# Altium project Orient.PrjPcb (part 4 of 6)

## Sheet FPGA_Banks_Anti_Alias.SchDoc
size A
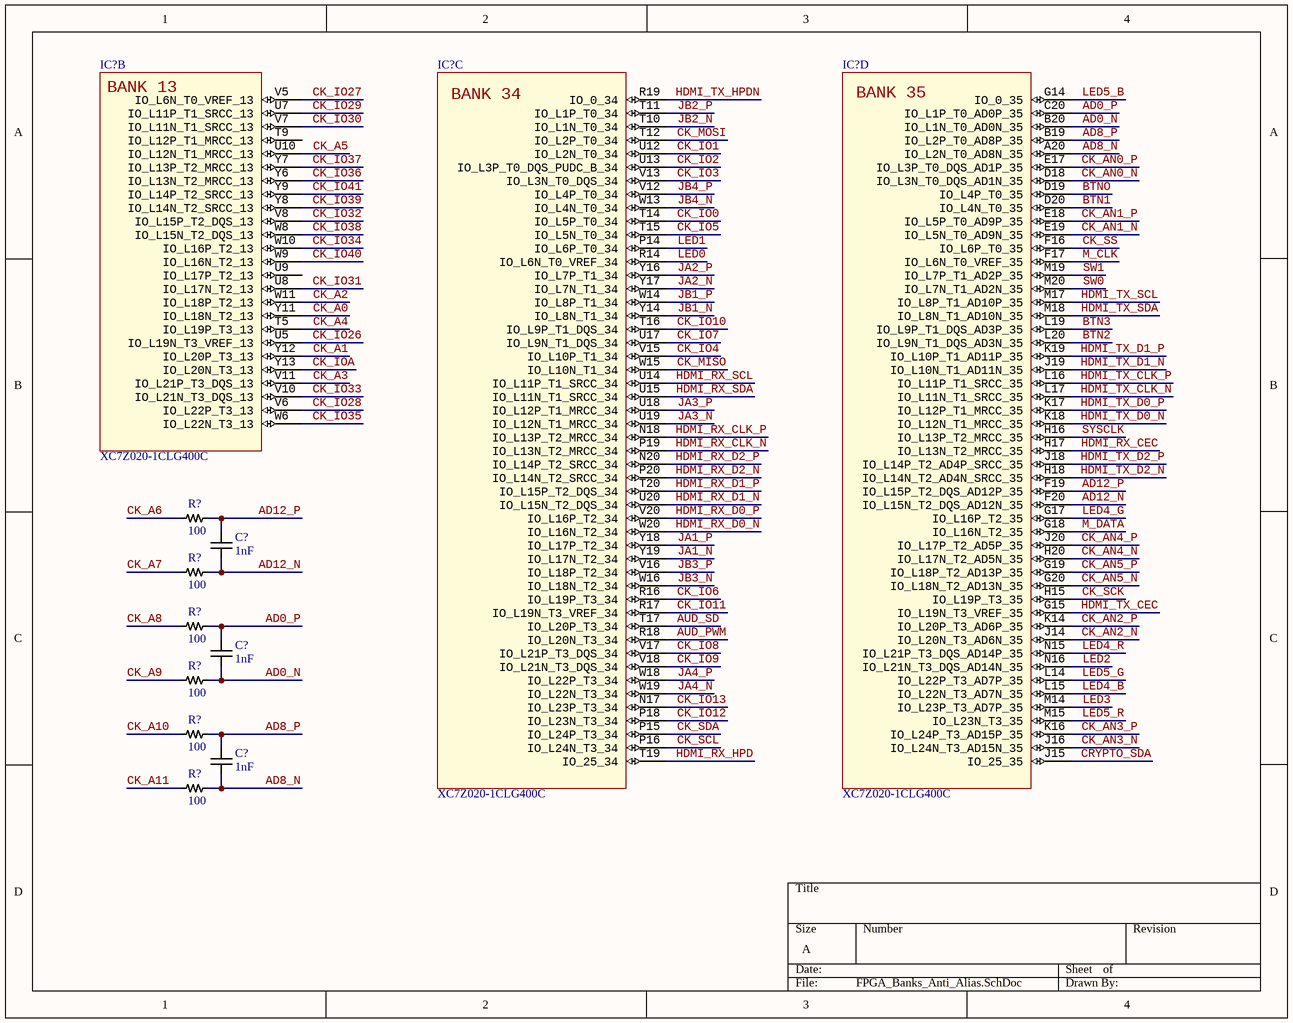
[diagram p6: FPGA_Banks_Anti_Alias.SchDoc]

### Parts
(Parts that share a designator on the sheet are numbered #1, #2 ... from top to bottom, then left to right.)
C?#13  1nF  [CAP0402]
C?#14  1nF  [CAP0402]
C?#15  1nF  [CAP0402]
IC?#8  XC7Z020-1CLG400C  [BGA400]  (part B of 9)
IC?#9  XC7Z020-1CLG400C  [BGA400]  (part C of 9)
IC?#10  XC7Z020-1CLG400C  [BGA400]  (part D of 9)
R?#129  100  [RES0402]
R?#130  100  [RES0402]
R?#131  100  [RES0402]
R?#132  100  [RES0402]
R?#133  100  [RES0402]
R?#134  100  [RES0402]

### Nets
AD0_N: C?#14.2 IC?#10.B20(IO_L1N_T0_AD0N_35) R?#132.2
AD0_P: C?#14.1 IC?#10.C20(IO_L1P_T0_AD0P_35) R?#131.2
AD8_N: C?#15.2 IC?#10.A20(IO_L2N_T0_AD8N_35) R?#134.2
AD8_P: C?#15.1 IC?#10.B19(IO_L2P_T0_AD8P_35) R?#133.2
AD12_N: C?#13.2 IC?#10.F20(IO_L15N_T2_DQS_AD12N_35) R?#130.2
AD12_P: C?#13.1 IC?#10.F19(IO_L15P_T2_DQS_AD12P_35) R?#129.2
AUD_PWM: IC?#9.R18(IO_L20N_T3_34)
AUD_SD: IC?#9.T17(IO_L20P_T3_34)
BTN1: IC?#10.D20(IO_L4N_T0_35)
BTN2: IC?#10.L20(IO_L9N_T1_DQS_AD3N_35)
BTN3: IC?#10.L19(IO_L9P_T1_DQS_AD3P_35)
BTNO: IC?#10.D19(IO_L4P_T0_35)
CK_A0: IC?#8.Y11(IO_L18N_T2_13)
CK_A1: IC?#8.Y12(IO_L20P_T3_13)
CK_A2: IC?#8.W11(IO_L18P_T2_13)
CK_A3: IC?#8.V11(IO_L21P_T3_DQS_13)
CK_A4: IC?#8.T5(IO_L19P_T3_13)
CK_A5: IC?#8.U10(IO_L12N_T1_MRCC_13)
CK_A6: R?#129.1
CK_A7: R?#130.1
CK_A8: R?#131.1
CK_A9: R?#132.1
CK_A10: R?#133.1
CK_A11: R?#134.1
CK_AN0_N: IC?#10.D18(IO_L3N_T0_DQS_AD1N_35)
CK_AN0_P: IC?#10.E17(IO_L3P_T0_DQS_AD1P_35)
CK_AN1_N: IC?#10.E19(IO_L5N_T0_AD9N_35)
CK_AN1_P: IC?#10.E18(IO_L5P_T0_AD9P_35)
CK_AN2_N: IC?#10.J14(IO_L20N_T3_AD6N_35)
CK_AN2_P: IC?#10.K14(IO_L20P_T3_AD6P_35)
CK_AN3_N: IC?#10.J16(IO_L24N_T3_AD15N_35)
CK_AN3_P: IC?#10.K16(IO_L24P_T3_AD15P_35)
CK_AN4_N: IC?#10.H20(IO_L17N_T2_AD5N_35)
CK_AN4_P: IC?#10.J20(IO_L17P_T2_AD5P_35)
CK_AN5_N: IC?#10.G20(IO_L18N_T2_AD13N_35)
CK_AN5_P: IC?#10.G19(IO_L18P_T2_AD13P_35)
CK_IO0: IC?#9.T14(IO_L5P_T0_34)
CK_IO1: IC?#9.U12(IO_L2N_T0_34)
CK_IO2: IC?#9.U13(IO_L3P_T0_DQS_PUDC_B_34)
CK_IO3: IC?#9.V13(IO_L3N_T0_DQS_34)
CK_IO4: IC?#9.V15(IO_L10P_T1_34)
CK_IO5: IC?#9.T15(IO_L5N_T0_34)
CK_IO6: IC?#9.R16(IO_L19P_T3_34)
CK_IO7: IC?#9.U17(IO_L9N_T1_DQS_34)
CK_IO8: IC?#9.V17(IO_L21P_T3_DQS_34)
CK_IO9: IC?#9.V18(IO_L21N_T3_DQS_34)
CK_IO10: IC?#9.T16(IO_L9P_T1_DQS_34)
CK_IO11: IC?#9.R17(IO_L19N_T3_VREF_34)
CK_IO12: IC?#9.P18(IO_L23N_T3_34)
CK_IO13: IC?#9.N17(IO_L23P_T3_34)
CK_IO26: IC?#8.U5(IO_L19N_T3_VREF_13)
CK_IO27: IC?#8.V5(IO_L6N_T0_VREF_13)
CK_IO28: IC?#8.V6(IO_L22P_T3_13)
CK_IO29: IC?#8.U7(IO_L11P_T1_SRCC_13)
CK_IO30: IC?#8.V7(IO_L11N_T1_SRCC_13)
CK_IO31: IC?#8.U8(IO_L17N_T2_13)
CK_IO32: IC?#8.V8(IO_L15P_T2_DQS_13)
CK_IO33: IC?#8.V10(IO_L21N_T3_DQS_13)
CK_IO34: IC?#8.W10(IO_L16P_T2_13)
CK_IO35: IC?#8.W6(IO_L22N_T3_13)
CK_IO36: IC?#8.Y6(IO_L13N_T2_MRCC_13)
CK_IO37: IC?#8.Y7(IO_L13P_T2_MRCC_13)
CK_IO38: IC?#8.W8(IO_L15N_T2_DQS_13)
CK_IO39: IC?#8.Y8(IO_L14N_T2_SRCC_13)
CK_IO40: IC?#8.W9(IO_L16N_T2_13)
CK_IO41: IC?#8.Y9(IO_L14P_T2_SRCC_13)
CK_IOA: IC?#8.Y13(IO_L20N_T3_13)
CK_MISO: IC?#9.W15(IO_L10N_T1_34)
CK_MOSI: IC?#9.T12(IO_L2P_T0_34)
CK_SCK: IC?#10.H15(IO_L19P_T3_35)
CK_SCL: IC?#9.P16(IO_L24N_T3_34)
CK_SDA: IC?#9.P15(IO_L24P_T3_34)
CK_SS: IC?#10.F16(IO_L6P_T0_35)
CRYPTO_SDA: IC?#10.J15(IO_25_35)
HDMI_RX_CEC: IC?#10.H17(IO_L13N_T2_MRCC_35)
HDMI_RX_CLK_N: IC?#9.P19(IO_L13N_T2_MRCC_34)
HDMI_RX_CLK_P: IC?#9.N18(IO_L13P_T2_MRCC_34)
HDMI_RX_D0_N: IC?#9.W20(IO_L16N_T2_34)
HDMI_RX_D0_P: IC?#9.V20(IO_L16P_T2_34)
HDMI_RX_D1_N: IC?#9.U20(IO_L15N_T2_DQS_34)
HDMI_RX_D1_P: IC?#9.T20(IO_L15P_T2_DQS_34)
HDMI_RX_D2_N: IC?#9.P20(IO_L14N_T2_SRCC_34)
HDMI_RX_D2_P: IC?#9.N20(IO_L14P_T2_SRCC_34)
HDMI_RX_HPD: IC?#9.T19(IO_25_34)
HDMI_RX_SCL: IC?#9.U14(IO_L11P_T1_SRCC_34)
HDMI_RX_SDA: IC?#9.U15(IO_L11N_T1_SRCC_34)
HDMI_TX_CEC: IC?#10.G15(IO_L19N_T3_VREF_35)
HDMI_TX_CLK_N: IC?#10.L17(IO_L11N_T1_SRCC_35)
HDMI_TX_CLK_P: IC?#10.L16(IO_L11P_T1_SRCC_35)
HDMI_TX_D0_N: IC?#10.K18(IO_L12N_T1_MRCC_35)
HDMI_TX_D0_P: IC?#10.K17(IO_L12P_T1_MRCC_35)
HDMI_TX_D1_N: IC?#10.J19(IO_L10N_T1_AD11N_35)
HDMI_TX_D1_P: IC?#10.K19(IO_L10P_T1_AD11P_35)
HDMI_TX_D2_N: IC?#10.H18(IO_L14N_T2_AD4N_SRCC_35)
HDMI_TX_D2_P: IC?#10.J18(IO_L14P_T2_AD4P_SRCC_35)
HDMI_TX_HPDN: IC?#9.R19(IO_0_34)
HDMI_TX_SCL: IC?#10.M17(IO_L8P_T1_AD10P_35)
HDMI_TX_SDA: IC?#10.M18(IO_L8N_T1_AD10N_35)
JA1_N: IC?#9.Y19(IO_L17N_T2_34)
JA1_P: IC?#9.Y18(IO_L17P_T2_34)
JA2_N: IC?#9.Y17(IO_L7N_T1_34)
JA2_P: IC?#9.Y16(IO_L7P_T1_34)
JA3_N: IC?#9.U19(IO_L12N_T1_MRCC_34)
JA3_P: IC?#9.U18(IO_L12P_T1_MRCC_34)
JA4_N: IC?#9.W19(IO_L22N_T3_34)
JA4_P: IC?#9.W18(IO_L22P_T3_34)
JB1_N: IC?#9.Y14(IO_L8N_T1_34)
JB1_P: IC?#9.W14(IO_L8P_T1_34)
JB2_N: IC?#9.T10(IO_L1N_T0_34)
JB2_P: IC?#9.T11(IO_L1P_T0_34)
JB3_N: IC?#9.W16(IO_L18N_T2_34)
JB3_P: IC?#9.V16(IO_L18P_T2_34)
JB4_N: IC?#9.W13(IO_L4N_T0_34)
JB4_P: IC?#9.V12(IO_L4P_T0_34)
LED0: IC?#9.R14(IO_L6N_T0_VREF_34)
LED1: IC?#9.P14(IO_L6P_T0_34)
LED2: IC?#10.N16(IO_L21N_T3_DQS_AD14N_35)
LED3: IC?#10.M14(IO_L23P_T3_AD7P_35)
LED4_B: IC?#10.L15(IO_L22N_T3_AD7N_35)
LED4_G: IC?#10.G17(IO_L16P_T2_35)
LED4_R: IC?#10.N15(IO_L21P_T3_DQS_AD14P_35)
LED5_B: IC?#10.G14(IO_0_35)
LED5_G: IC?#10.L14(IO_L22P_T3_AD7P_35)
LED5_R: IC?#10.M15(IO_L23N_T3_35)
M_CLK: IC?#10.F17(IO_L6N_T0_VREF_35)
M_DATA: IC?#10.G18(IO_L16N_T2_35)
SW0: IC?#10.M20(IO_L7N_T1_AD2N_35)
SW1: IC?#10.M19(IO_L7P_T1_AD2P_35)
SYSCLK: IC?#10.H16(IO_L13P_T2_MRCC_35)

Not connected (* = marked no-connect by the designer): IC?#8 T9(IO_L12P_T1_MRCC_13) U9(IO_L17P_T2_13)

### Notes on the sheet
- (in symbol XC7Z020-1CLG400C, part B) BANK 13
- (in symbol XC7Z020-1CLG400C, part C) BANK 34
- (in symbol XC7Z020-1CLG400C, part D) BANK 35

### Library data of the parts
C?#13-C?#15 = GCM155R71H102KA37D: MLCC 1nF 0402 SMD; Manufacturer: Murata; Voltage Rating: 50V; Tolerance: 10%; Dielectric: X7R; Supplier 1: Digi-Key; Manufacturer Part Number: GCM155R71H102KA37D; Stock 1: 18060146; Pricing 1: 1=0.10000, 10=0.03900, 100=0.01720, 500=0.01228, 1000=0.00965, 2500=0.00878, 5000=0.00807 (USD); RoHS: Yes; Mount: Surface Mount; Case/Package: 0402; Case Code (Metric): 1005; Case Code (Imperial): 0402; Min Operating Temperature: -55°C; Max Operating Temperature: 125°C; Package Quantity: 1; Capacitance: 1nF; Packaging: Tape and Reel; Voltage Rating (DC): 50V; Termination: SMD/SMT; Voltage: 50V; Length: 1mm; Height: 0.5mm; Width: 0.02inch; Thickness: 0.022inch; Depth: 0.5mm; Ratings: AEC-Q200; Radiation Hardening: No; REACH SVHC: No SVHC; Lead Free: Lead Free; ComponentLink1URL: https://datasheet.ciiva.com/130/product-130720.pdf?src-supplier=Digi-Key; ComponentLink1Description: https://datasheet.ciiva.com/130/product-130720.pdf?src-supplier=Digi-Key; ComponentLink2URL: https://datasheet.ciiva.com/18183/getdatasheetpartid-140970-18183520.pdf?src-supplier=Verical; ComponentLink2Description: https://datasheet.ciiva.com/18183/getdatasheetpartid-140970-18183520.pdf?src-supplier=Verical; ComponentLink3URL: https://datasheet.ciiva.com/3778/3103gcm155r71h102ka3723-3778878.pdf?src-supplier=Arrow; ComponentLink3Description: https://datasheet.ciiva.com/3778/3103gcm155r71h102ka3723-3778878.pdf?src-supplier=Arrow; ComponentLink4URL: https://datasheet.ciiva.com/11786/0900766b80ef92d0-11786143.pdf?src-supplier=RSComponents; ComponentLink4Description: https://datasheet.ciiva.com/11786/0900766b80ef92d0-11786143.pdf?src-supplier=RSComponents; ComponentLink5URL: https://datasheet.ciiva.com/16213/product-16213384.pdf?src-supplier=Future+Electronics; ComponentLink5Description: https://datasheet.ciiva.com/16213/product-16213384.pdf?src-supplier=Future+Electronics
IC?#8-IC?#10 = XC7Z020-1CLG400C: Zynq-7000 SoC.; ComponentLink1Description: Digi-Key; ComponentLink1URL: https://www.digikey.com/product-detail/en/xilinx-inc/XC7Z020-1CLG400C/122-1851-ND/3925758?utm_adgroup=Integrated Circuits&slid=&gclid=Cj0KCQjwn_LrBRD4ARIsAFEQFKtYXIOPieaS_xsLL2AvFALkVw3M5siD0KQOWM0owpA_yiQuHKATBqcaAuQ6EALw_wcB
R?#129-R?#134 = RC0402FR-07100RL: Resistor 100Ohm 0402 SMD; Manufacturer: Yageo; Power Rating: 62.5mW; Tolerance: 1%; Voltage Rating: 50V; Resistance: 100R; Temperature Coefficient: 100ppm/°C; Supplier 1: Digi-Key; Manufacturer Part Number: RC0402FR-07100RL; Stock 1: 46531178; Pricing 1: 1=0.10000, 10=0.01600, 100=0.00670, 1000=0.00301, 2500=0.00261, 5000=0.00215 (USD); RoHS: Yes; Case/Package: 0402; Number of Pins: 2; Case Code (Imperial): 0402; Case Code (Metric): 1005; Min Operating Temperature: -55°C; Max Operating Temperature: 155°C; Packaging: Tape and Reel; Termination: SMD/SMT; Composition: Thick Film; Military Standard: Not; Voltage Rating (DC): 50V; Length: 1mm; Height: 0.32mm; Depth: 0.5mm; Width: 0.5mm; REACH SVHC: No SVHC; Lead Free: Lead Free; ComponentLink1URL: https://datasheet.ciiva.com/7849/1784430-7849810.pdf?src-supplier=Element14; ComponentLink1Description: https://datasheet.ciiva.com/7849/1784430-7849810.pdf?src-supplier=Element14; ComponentLink2URL: https://datasheet.ciiva.com/11808/0900766b80c66297-11808765.pdf?src-supplier=RSComponents; ComponentLink2Description: https://datasheet.ciiva.com/11808/0900766b80c66297-11808765.pdf?src-supplier=RSComponents; ComponentLink3URL: https://datasheet.ciiva.com/12667/pyu-rc0402-51-rohs-l-6-r-12667957.pdf?src-supplier=Mouser; ComponentLink3Description: https://datasheet.ciiva.com/12667/pyu-rc0402-51-rohs-l-6-r-12667957.pdf?src-supplier=Mouser; ComponentLink4URL: https://datasheet.ciiva.com/22747/1018594-22747511.pdf?src-supplier=Element14; ComponentLink4Description: https://datasheet.ciiva.com/22747/1018594-22747511.pdf?src-supplier=Element14; ComponentLink5URL: https://datasheet.ciiva.com/28367/1018594-28367226.pdf?src-supplier=Element14; ComponentLink5Description: https://datasheet.ciiva.com/28367/1018594-28367226.pdf?src-supplier=Element14; ComponentLink6URL: https://datasheet.ciiva.com/16740/pyu-rc0402-51-rohs-l-6-r-16740566.pdf?src-supplier=Future+Electronics; ComponentLink6Description: https://datasheet.ciiva.com/16740/pyu-rc0402-51-rohs-l-6-r-16740566.pdf?src-supplier=Future+Electronics; ComponentLink7URL: https://datasheet.ciiva.com/15189/getdatasheetpartid-329466-15189335.pdf?src-supplier=Verical; ComponentLink7Description: https://datasheet.ciiva.com/15189/getdatasheetpartid-329466-15189335.pdf?src-supplier=Verical

## Sheet FPGA_Power.SchDoc
size A
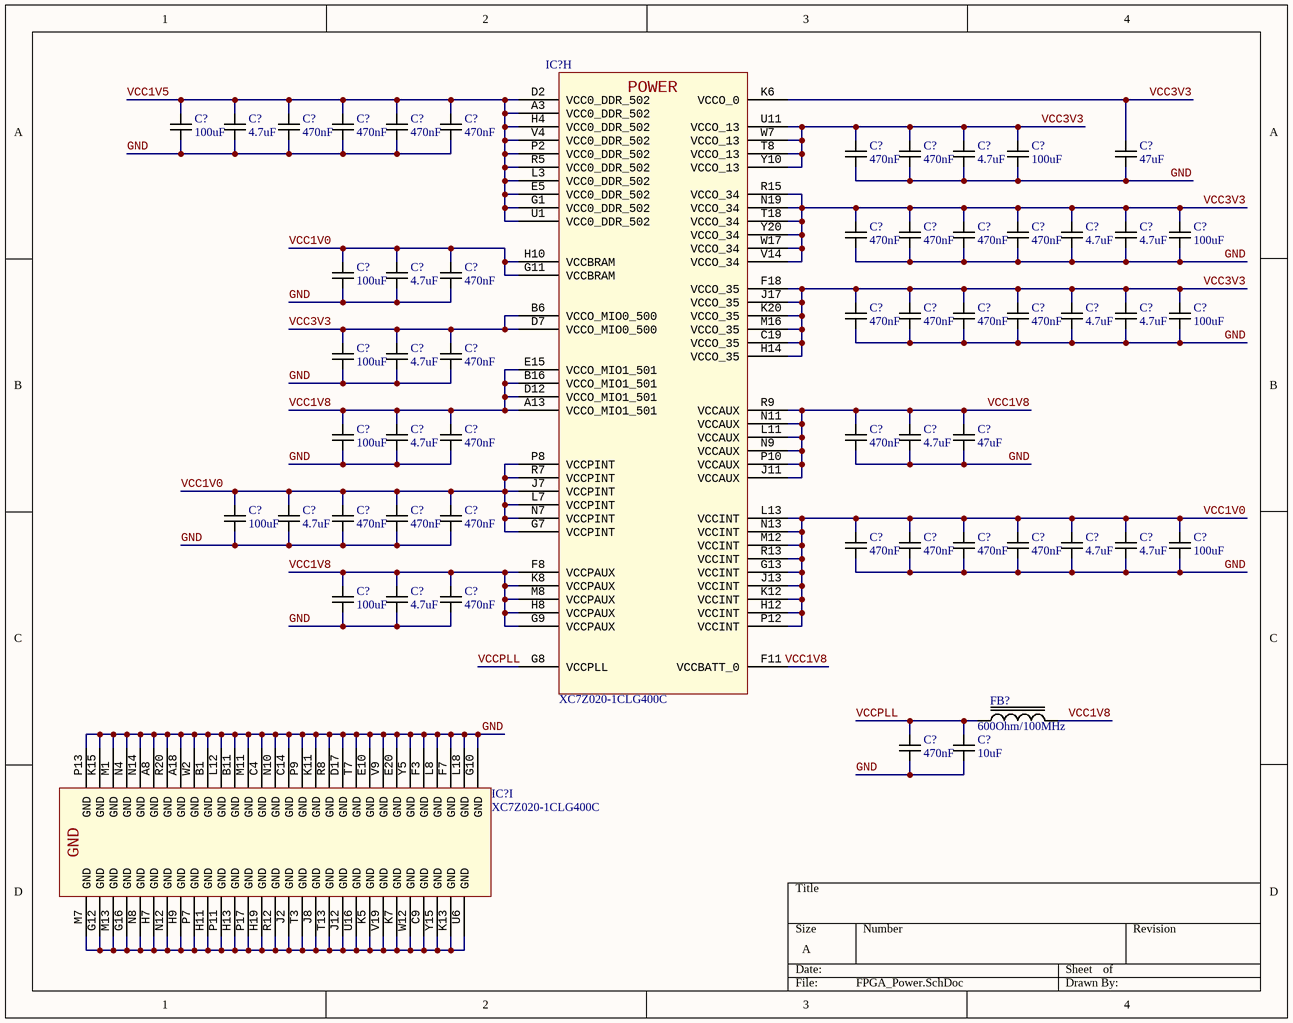
[diagram p7: FPGA_Power.SchDoc]

### Parts
(Parts that share a designator on the sheet are numbered #1, #2 ... from top to bottom, then left to right.)
C?#16  100uF
C?#17  4.7uF  [CAP0805]
C?#18  470nF  [CAP0603]
C?#19  470nF  [CAP0603]
C?#20  470nF  [CAP0603]
C?#21  470nF  [CAP0603]
C?#22  470nF  [CAP0603]
C?#23  470nF  [CAP0603]
C?#24  4.7uF  [CAP0805]
C?#25  100uF
C?#26  47uF  [CAP1210]
C?#27  470nF  [CAP0603]
C?#28  470nF  [CAP0603]
C?#29  470nF  [CAP0603]
C?#30  470nF  [CAP0603]
C?#31  4.7uF  [CAP0805]
C?#32  4.7uF  [CAP0805]
C?#33  100uF
C?#34  100uF
C?#35  4.7uF  [CAP0805]
C?#36  470nF  [CAP0603]
C?#37  470nF  [CAP0603]
C?#38  470nF  [CAP0603]
C?#39  470nF  [CAP0603]
C?#40  470nF  [CAP0603]
C?#41  4.7uF  [CAP0805]
C?#42  4.7uF  [CAP0805]
C?#43  100uF
C?#44  100uF
C?#45  4.7uF  [CAP0805]
C?#46  470nF  [CAP0603]
C?#47  100uF
C?#48  4.7uF  [CAP0805]
C?#49  470nF  [CAP0603]
C?#50  470nF  [CAP0603]
C?#51  4.7uF  [CAP0805]
C?#52  47uF  [CAP1210]
C?#53  100uF
C?#54  4.7uF  [CAP0805]
C?#55  470nF  [CAP0603]
C?#56  470nF  [CAP0603]
C?#57  470nF  [CAP0603]
C?#58  470nF  [CAP0603]
C?#59  470nF  [CAP0603]
C?#60  470nF  [CAP0603]
C?#61  470nF  [CAP0603]
C?#62  4.7uF  [CAP0805]
C?#63  4.7uF  [CAP0805]
C?#64  100uF
C?#65  100uF
C?#66  4.7uF  [CAP0805]
C?#67  470nF  [CAP0603]
C?#68  470nF  [CAP0603]
C?#69  10uF  [CAP0805]
FB?#4  600Ohm/100MHz  [FB0805]
IC?#11  XC7Z020-1CLG400C  [BGA400]  (part H of 9)
IC?#12  XC7Z020-1CLG400C  [BGA400]  (part I of 9)

### Nets
GND: C?#16.?2 C?#17.2 C?#18.2 C?#19.2 C?#20.2 C?#21.2 C?#22.2 C?#23.2 C?#24.2 C?#25.?2 C?#26.2 C?#27.2 C?#28.2 C?#29.2 C?#30.2 C?#31.2 C?#32.2 C?#33.?2 C?#34.?2 C?#35.2 C?#36.2 C?#37.2 C?#38.2 C?#39.2 C?#40.2 C?#41.2 C?#42.2 C?#43.?2 C?#44.?2 C?#45.2 C?#46.2 C?#47.?2 C?#48.2 C?#49.2 C?#50.2 C?#51.2 C?#52.2 C?#53.?2 C?#54.2 C?#55.2 C?#56.2 C?#57.2 C?#58.2 C?#59.2 C?#60.2 C?#61.2 C?#62.2 C?#63.2 C?#64.?2 C?#65.?2 C?#66.2 C?#67.2 C?#68.2 C?#69.2 IC?#12.A8(GND) IC?#12.A18(GND) IC?#12.B1(GND) IC?#12.B11(GND) IC?#12.C4(GND) IC?#12.C14(GND) IC?#12.D17(GND) IC?#12.E10(GND) IC?#12.E20(GND) IC?#12.F3(GND) IC?#12.F7(GND) IC?#12.G10(GND) IC?#12.K11(GND) IC?#12.K15(GND) IC?#12.L8(GND) IC?#12.L12(GND) IC?#12.L18(GND) IC?#12.M1(GND) IC?#12.M11(GND) IC?#12.N4(GND) IC?#12.N10(GND) IC?#12.N14(GND) IC?#12.P9(GND) IC?#12.P13(GND) IC?#12.R8(GND) IC?#12.R20(GND) IC?#12.T7(GND) IC?#12.V9(GND) IC?#12.W2(GND) IC?#12.Y5(GND)
VCC1V0: C?#34.?1 C?#35.1 C?#36.1 C?#53.?1 C?#54.1 C?#55.1 C?#56.1 C?#57.1 C?#58.1 C?#59.1 C?#60.1 C?#61.1 C?#62.1 C?#63.1 C?#64.?1 IC?#11.G7(VCCPINT) IC?#11.G11(VCCBRAM) IC?#11.G13(VCCINT) IC?#11.H10(VCCBRAM) IC?#11.H12(VCCINT) IC?#11.J7(VCCPINT) IC?#11.J13(VCCINT) IC?#11.K12(VCCINT) IC?#11.L7(VCCPINT) IC?#11.L13(VCCINT) IC?#11.M12(VCCINT) IC?#11.N7(VCCPINT) IC?#11.N13(VCCINT) IC?#11.P8(VCCPINT) IC?#11.P12(VCCINT) IC?#11.R7(VCCPINT) IC?#11.R13(VCCINT)
VCC1V5: C?#16.?1 C?#17.1 C?#18.1 C?#19.1 C?#20.1 C?#21.1 IC?#11.A3(VCC0_DDR_502) IC?#11.D2(VCC0_DDR_502) IC?#11.E5(VCC0_DDR_502) IC?#11.G1(VCC0_DDR_502) IC?#11.H4(VCC0_DDR_502) IC?#11.L3(VCC0_DDR_502) IC?#11.P2(VCC0_DDR_502) IC?#11.R5(VCC0_DDR_502) IC?#11.U1(VCC0_DDR_502) IC?#11.V4(VCC0_DDR_502)
VCC1V8: C?#47.?1 C?#48.1 C?#49.1 C?#50.1 C?#51.1 C?#52.1 C?#65.?1 C?#66.1 C?#67.1 FB?#4.2 IC?#11.A13(VCCO_MIO1_501) IC?#11.B16(VCCO_MIO1_501) IC?#11.D12(VCCO_MIO1_501) IC?#11.E15(VCCO_MIO1_501) IC?#11.F8(VCCPAUX) IC?#11.F11(VCCBATT_0) IC?#11.G9(VCCPAUX) IC?#11.H8(VCCPAUX) IC?#11.J11(VCCAUX) IC?#11.K8(VCCPAUX) IC?#11.L11(VCCAUX) IC?#11.M8(VCCPAUX) IC?#11.N9(VCCAUX) IC?#11.N11(VCCAUX) IC?#11.P10(VCCAUX) IC?#11.R9(VCCAUX)
VCC3V3: C?#22.1 C?#23.1 C?#24.1 C?#25.?1 C?#26.1 C?#27.1 C?#28.1 C?#29.1 C?#30.1 C?#31.1 C?#32.1 C?#33.?1 C?#37.1 C?#38.1 C?#39.1 C?#40.1 C?#41.1 C?#42.1 C?#43.?1 C?#44.?1 C?#45.1 C?#46.1 IC?#11.B6(VCCO_MIO0_500) IC?#11.C19(VCCO_35) IC?#11.D7(VCCO_MIO0_500) IC?#11.F18(VCCO_35) IC?#11.H14(VCCO_35) IC?#11.J17(VCCO_35) IC?#11.K6(VCCO_0) IC?#11.K20(VCCO_35) IC?#11.M16(VCCO_35) IC?#11.N19(VCCO_34) IC?#11.R15(VCCO_34) IC?#11.T8(VCCO_13) IC?#11.T18(VCCO_34) IC?#11.U11(VCCO_13) IC?#11.V14(VCCO_34) IC?#11.W7(VCCO_13) IC?#11.W17(VCCO_34) IC?#11.Y10(VCCO_13) IC?#11.Y20(VCCO_34)
VCCPLL: C?#68.1 C?#69.1 FB?#4.1 IC?#11.G8(VCCPLL)
NetIC?#12_C9: IC?#12.C9(GND) IC?#12.G12(GND) IC?#12.G16(GND) IC?#12.H7(GND) IC?#12.H9(GND) IC?#12.H11(GND) IC?#12.H13(GND) IC?#12.H19(GND) IC?#12.J2(GND) IC?#12.J8(GND) IC?#12.J12(GND) IC?#12.K5(GND) IC?#12.K7(GND) IC?#12.K13(GND) IC?#12.M7(GND) IC?#12.M13(GND) IC?#12.N8(GND) IC?#12.N12(GND) IC?#12.P7(GND) IC?#12.P11(GND) IC?#12.P17(GND) IC?#12.R12(GND) IC?#12.T3(GND) IC?#12.T13(GND) IC?#12.U6(GND) IC?#12.U16(GND) IC?#12.V19(GND) IC?#12.W12(GND) IC?#12.Y15(GND)

### Notes on the sheet
- (in symbol XC7Z020-1CLG400C, part H) POWER

### Library data of the parts
C?#16 C?#25 C?#33 C?#34 C?#43 C?#44 C?#47 C?#53 C?#64 C?#65 = 100uF: MLCC 100uF 1210 SMD; Manufacturer: Murata; Manufacturer Part Number: GRM32EE70G107ME19L; Material: Ceramic; Tolerance: 20%; Voltage Rating (DC): 4V; Dielectric: X7U; Supplier 1: Digi-Key; Stock 1: 18905; Pricing 1: 1=1.27000, 10=1.00100, 100=0.75060, 500=0.56716 (USD); RoHS: Yes; Mount: Surface Mount; Case/Package: 1210; Number of Pins: 2; Case Code (Imperial): 1210; Case Code (Metric): 3225; Min Operating Temperature: -55°C; Max Operating Temperature: 125°C; Capacitance: 100uF; Packaging: Tape and Reel; Termination: SMD/SMT; Voltage Rating: 4V; Package Quantity: 1; Length: 3.2mm; Height: 2.5mm; Width: 2.5mm; Thickness: 0.106inch; Depth: 2.5mm; Lead Pitch: 1mm; Radiation Hardening: No; REACH SVHC: No SVHC; Lead Free: Lead Free; ComponentLink1URL: https://datasheet.ciiva.com/5422/product-5422439.pdf?src-supplier=Mouser; ComponentLink1Description: https://datasheet.ciiva.com/5422/product-5422439.pdf?src-supplier=Mouser; ComponentLink2URL: https://datasheet.ciiva.com/6264/partnumbering-e-01-6264538.pdf?src-supplier=Digi-Key; ComponentLink2Description: https://datasheet.ciiva.com/6264/partnumbering-e-01-6264538.pdf?src-supplier=Digi-Key; ComponentLink3URL: https://datasheet.ciiva.com/7719/1303574-7719178.pdf?src-supplier=Element14; ComponentLink3Description: https://datasheet.ciiva.com/7719/1303574-7719178.pdf?src-supplier=Element14; ComponentLink4URL: https://datasheet.ciiva.com/6264/partnumbering-e-01-6264539.pdf?src-supplier=Digi-Key; ComponentLink4Description: https://datasheet.ciiva.com/6264/partnumbering-e-01-6264539.pdf?src-supplier=Digi-Key; ComponentLink5URL: https://datasheet.ciiva.com/14116/grmseries-highdielectrictype-eng-14116427.pdf?src-supplier=Distrelec; ComponentLink5Description: https://datasheet.ciiva.com/14116/grmseries-highdielectrictype-eng-14116427.pdf?src-supplier=Distrelec; ComponentLink6URL: https://datasheet.ciiva.com/6264/partnumbering-e-01-6264540.pdf?src-supplier=Digi-Key; ComponentLink6Description: https://datasheet.ciiva.com/6264/partnumbering-e-01-6264540.pdf?src-supplier=Digi-Key; ComponentLink7URL: https://datasheet.ciiva.com/11605/product-11605486.pdf?src-supplier=Avnet; ComponentLink7Description: https://datasheet.ciiva.com/11605/product-11605486.pdf?src-supplier=Avnet
C?#17 C?#24 C?#31 C?#32 C?#35 C?#41 C?#42 C?#45 C?#48 C?#51 C?#54 C?#62 C?#63 C?#66 = C2012X7R1A475K085AC: MLCC 4.7uF 0805 SMD; Manufacturer: TDK; Dielectric Material: Ceramic; Tolerance: 10%; Voltage Rating: 10V; Dielectric: X7R; Supplier 1: Digi-Key; Manufacturer Part Number: C2012X7R1A475K085AC; Stock 1: 87407; Pricing 1: 1=0.22000, 10=0.15200, 100=0.08600, 500=0.06072, 1000=0.05313 (USD); RoHS: Yes; Mount: Surface Mount; Case/Package: 0805; Case Code (Metric): 2012; Case Code (Imperial): 0805; Min Operating Temperature: -55°C; Max Operating Temperature: 125°C; Package Quantity: 4000; Packaging: Cut Tape; Capacitance: 4.7uF; Voltage Rating (DC): 10V; Length: 0.079inch; Width: 0.049inch; Thickness: 0.039inch; REACH SVHC: No SVHC; Lead Free: Lead Free; ComponentLink1URL: https://datasheet.ciiva.com/14886/tdkmlcccaprange-14886121.pdf?src-supplier=Digi-Key; ComponentLink1Description: https://datasheet.ciiva.com/14886/tdkmlcccaprange-14886121.pdf?src-supplier=Digi-Key; ComponentLink2URL: https://product.tdk.com/info/en/catalog/datasheets/mlcc_commercial_general_en.pdf; ComponentLink2Description: https://product.tdk.com/info/en/catalog/datasheets/mlcc_commercial_general_en.pdf
C?#18-C?#23 C?#27-C?#30 C?#36-C?#40 C?#46 C?#49 C?#50 C?#55-C?#61 C?#67 C?#68 = GRM188R70J474KA01D: MLCC 470nF 0603 SMD; pin to pad: 2>none; Manufacturer: Murata; Voltage Rating: 6.3V; Tolerance: 10%; Dielectric: X7R; Supplier 1: Digi-Key; Manufacturer Part Number: GRM188R70J474KA01D; Stock 1: 92537; Pricing 1: 1=0.17000, 10=0.11700, 100=0.05940, 500=0.04066, 1000=0.03597 (USD); RoHS: Yes; Mount: Surface Mount; Case/Package: 0603; Case Code (Metric): 1608; Case Code (Imperial): 0603; Min Operating Temperature: -55°C; Max Operating Temperature: 125°C; Package Quantity: 4000; Capacitance: 470nF; Packaging: Tape and Reel; Voltage Rating (DC): 6.3V; Termination: SMD/SMT; Length: 1.6mm; Height: 0.8mm; Width: 0.031inch; Thickness: 0.035inch; Depth: 0.8mm; Radiation Hardening: No; Lead Free: Lead Free; ComponentLink1URL: https://datasheet.ciiva.com/6264/product-6264161.pdf?src-supplier=Digi-Key; ComponentLink1Description: https://datasheet.ciiva.com/6264/product-6264161.pdf?src-supplier=Digi-Key; ComponentLink2URL: https://datasheet.ciiva.com/11673/product-11673478.pdf?src-supplier=Avnet; ComponentLink2Description: https://datasheet.ciiva.com/11673/product-11673478.pdf?src-supplier=Avnet; ComponentLink3URL: https://datasheet.ciiva.com/6264/partnumbering-e-01-6264159.pdf?src-supplier=Digi-Key; ComponentLink3Description: https://datasheet.ciiva.com/6264/partnumbering-e-01-6264159.pdf?src-supplier=Digi-Key
C?#26 C?#52 = GRM32ER70J476ME20L: MLCC 47uF 1210 SMD; Manufacturer: Murata; Tolerance: 20%; Voltage Rating: 6.3V; Dielectric: X7R; Supplier 1: Digi-Key; Manufacturer Part Number: GRM32ER70J476ME20L; Stock 1: 32926; Pricing 1: 1=2.11000, 10=1.70900, 100=1.30480, 500=0.99416 (USD); RoHS: Yes; Mount: Surface Mount; Case/Package: 1210; Case Code (Metric): 3225; Case Code (Imperial): 1210; Min Operating Temperature: -55°C; Max Operating Temperature: 125°C; Package Quantity: 1; Packaging: Tape and Reel; Capacitance: 47uF; Voltage Rating (DC): 6.3V; Termination: SMD/SMT; Length: 3.2mm; Height: 2.5mm; Width: 0.098inch; Thickness: 0.106inch; Depth: 2.5mm; Radiation Hardening: No; Lead Free: Lead Free; ComponentLink1URL: https://datasheet.ciiva.com/6264/partnumbering-e-01-6264582.pdf?src-supplier=Digi-Key; ComponentLink1Description: https://datasheet.ciiva.com/6264/partnumbering-e-01-6264582.pdf?src-supplier=Digi-Key; ComponentLink2URL: https://datasheet.ciiva.com/6264/partnumbering-e-01-6264583.pdf?src-supplier=Digi-Key; ComponentLink2Description: https://datasheet.ciiva.com/6264/partnumbering-e-01-6264583.pdf?src-supplier=Digi-Key; ComponentLink3URL: https://datasheet.ciiva.com/6264/partnumbering-e-01-6264585.pdf?src-supplier=Digi-Key; ComponentLink3Description: https://datasheet.ciiva.com/6264/partnumbering-e-01-6264585.pdf?src-supplier=Digi-Key; ComponentLink4URL: https://datasheet.ciiva.com/16497/product-16497003.pdf?src-supplier=Future+Electronics; ComponentLink4Description: https://datasheet.ciiva.com/16497/product-16497003.pdf?src-supplier=Future+Electronics
C?#69 = 08056D106KAT2A: MLCC 10uF 0805 SMD; Manufacturer: Kyocera AVX; Dielectric Material: Ceramic; Voltage Rating: 6.3V; Tolerance: 10%; Dielectric: X5R; Insulation Resistance: 500MR; Supplier 1: Digi-Key; Manufacturer Part Number: 08056D106KAT2A; Stock 1: 217962; Pricing 1: 1=0.50000, 10=0.35100, 100=0.23100, 500=0.17112, 1000=0.14545 (USD); RoHS: Yes; Mount: Surface Mount,PCB; Case/Package: 0805; Number of Pins: 2; Case Code (Imperial): 0805; Case Code (Metric): 2012; Min Operating Temperature: -55°C; Max Operating Temperature: 85°C; Capacitance: 10uF; Package Quantity: 1; Voltage Rating (DC): 6.3V; Packaging: Tape and Reel; Termination: SMD/SMT; Voltage: 6.3V; Length: 2.01mm; Height: 1.4mm; Width: 1.25mm; Thickness: 0.055inch; Depth: 1.25mm; Radiation Hardening: No; REACH SVHC: No SVHC; Lead Free: Lead Free; ComponentLink1URL: https://datasheet.ciiva.com/11788/0900766b80def1a5-11788549.pdf?src-supplier=RSComponents; ComponentLink1Description: https://datasheet.ciiva.com/11788/0900766b80def1a5-11788549.pdf?src-supplier=RSComponents; ComponentLink2URL: https://datasheet.ciiva.com/19467/2012662-19467718.pdf?src-supplier=Jameco; ComponentLink2Description: https://datasheet.ciiva.com/19467/2012662-19467718.pdf?src-supplier=Jameco; ComponentLink3URL: https://datasheet.ciiva.com/151/cx5r-151672.pdf?src-supplier=Digi-Key; ComponentLink3Description: https://datasheet.ciiva.com/151/cx5r-151672.pdf?src-supplier=Digi-Key; ComponentLink4URL: https://datasheet.ciiva.com/7812/26587-7812184.pdf?src-supplier=Element14; ComponentLink4Description: https://datasheet.ciiva.com/7812/26587-7812184.pdf?src-supplier=Element14; ComponentLink5URL: https://datasheet.ciiva.com/14598/70001028-14598616.pdf?src-supplier=Allied+Electronics; ComponentLink5Description: https://datasheet.ciiva.com/14598/70001028-14598616.pdf?src-supplier=Allied+Electronics; ComponentLink6URL: https://datasheet.ciiva.com/151/cx5r-151673.pdf?src-supplier=Digi-Key; ComponentLink6Description: https://datasheet.ciiva.com/151/cx5r-151673.pdf?src-supplier=Digi-Key; ComponentLink7URL: https://datasheet.ciiva.com/7812/26587-7812185.pdf?src-supplier=Element14; ComponentLink7Description: https://datasheet.ciiva.com/7812/26587-7812185.pdf?src-supplier=Element14; ComponentLink8URL: https://datasheet.ciiva.com/151/cx5r-151674.pdf?src-supplier=Digi-Key; ComponentLink8Description: https://datasheet.ciiva.com/151/cx5r-151674.pdf?src-supplier=Digi-Key; ComponentLink9URL: https://datasheet.ciiva.com/7812/1666675-7812186.pdf?src-supplier=Element14; ComponentLink9Description: https://datasheet.ciiva.com/7812/1666675-7812186.pdf?src-supplier=Element14; ComponentLink10URL: https://datasheet.ciiva.com/2988/cx5r-2988044.pdf?src-supplier=Avnet; ComponentLink10Description: https://datasheet.ciiva.com/2988/cx5r-2988044.pdf?src-supplier=Avnet; ComponentLink11URL: https://datasheet.ciiva.com/16392/cx5r-16392797.pdf?src-supplier=Future+Electronics; ComponentLink11Description: https://datasheet.ciiva.com/16392/cx5r-16392797.pdf?src-supplier=Future+Electronics; ComponentLink12URL: https://datasheet.ciiva.com/16544/cx5r-16544062.pdf?src-supplier=Avnet+Asia; ComponentLink12Description: https://datasheet.ciiva.com/16544/cx5r-16544062.pdf?src-supplier=Avnet+Asia
FB?#4 = HZ0805E601R-10: Ferrite Bead 600Ohm/100MHz 0805 SMD; Manufacturer: Laird; Current Rating: 500mA; Impedance: 600R; Number of Lines: 1; DC Resistance (DCR): 300mR; Test Frequency: 100MHz; Supplier 1: Digi-Key; Manufacturer Part Number: HZ0805E601R-10; Stock 1: 4500868; Pricing 1: 1=0.10000, 10=0.04700, 25=0.04160, 50=0.03800, 100=0.03420, 250=0.02504, 500=0.01822, 1000=0.01784 (USD); RoHS: Yes; Mount: Surface Mount; Case/Package: 0805; Weight: 0.00392oz; Case Code (Metric): 2012; Case Code (Imperial): 0805; Material: Ferrite; Contact Plating: Tin,Matte; Core Material: Ferrite; Min Operating Temperature: -40°C; Max Operating Temperature: 125°C; Package Quantity: 1; Packaging: Tape and Reel; Max Current Rating: 500mA; Max DC Current: 500mA; Termination: SMD/SMT; Frequency: 100MHz; Length: 2mm; Height: 1.25mm; Width: 0.049inch; Depth: 1.45mm; REACH SVHC: Unknown; Lead Free: Lead Free; ComponentLink1URL: https://datasheet.ciiva.com/22622/1685710-22622833.pdf?src-supplier=Element14; ComponentLink1Description: https://datasheet.ciiva.com/22622/1685710-22622833.pdf?src-supplier=Element14; ComponentLink2URL: https://datasheet.ciiva.com/1013/hz0805e601r-10-1013170.pdf?src-supplier=Digi-Key; ComponentLink2Description: https://datasheet.ciiva.com/1013/hz0805e601r-10-1013170.pdf?src-supplier=Digi-Key; ComponentLink3URL: https://datasheet.ciiva.com/8512/hz0805e601r-10-a-vp-8512772.pdf?src-supplier=Avnet; ComponentLink3Description: https://datasheet.ciiva.com/8512/hz0805e601r-10-a-vp-8512772.pdf?src-supplier=Avnet; ComponentLink4URL: https://datasheet.ciiva.com/16714/70065439-16714006.pdf?src-supplier=Allied+Electronics; ComponentLink4Description: https://datasheet.ciiva.com/16714/70065439-16714006.pdf?src-supplier=Allied+Electronics
IC?#11 IC?#12 = XC7Z020-1CLG400C: Zynq-7000 SoC.; ComponentLink1Description: Digi-Key; ComponentLink1URL: https://www.digikey.com/product-detail/en/xilinx-inc/XC7Z020-1CLG400C/122-1851-ND/3925758?utm_adgroup=Integrated Circuits&slid=&gclid=Cj0KCQjwn_LrBRD4ARIsAFEQFKtYXIOPieaS_xsLL2AvFALkVw3M5siD0KQOWM0owpA_yiQuHKATBqcaAuQ6EALw_wcB

## Sheet DDR3_Memory.SchDoc
size A
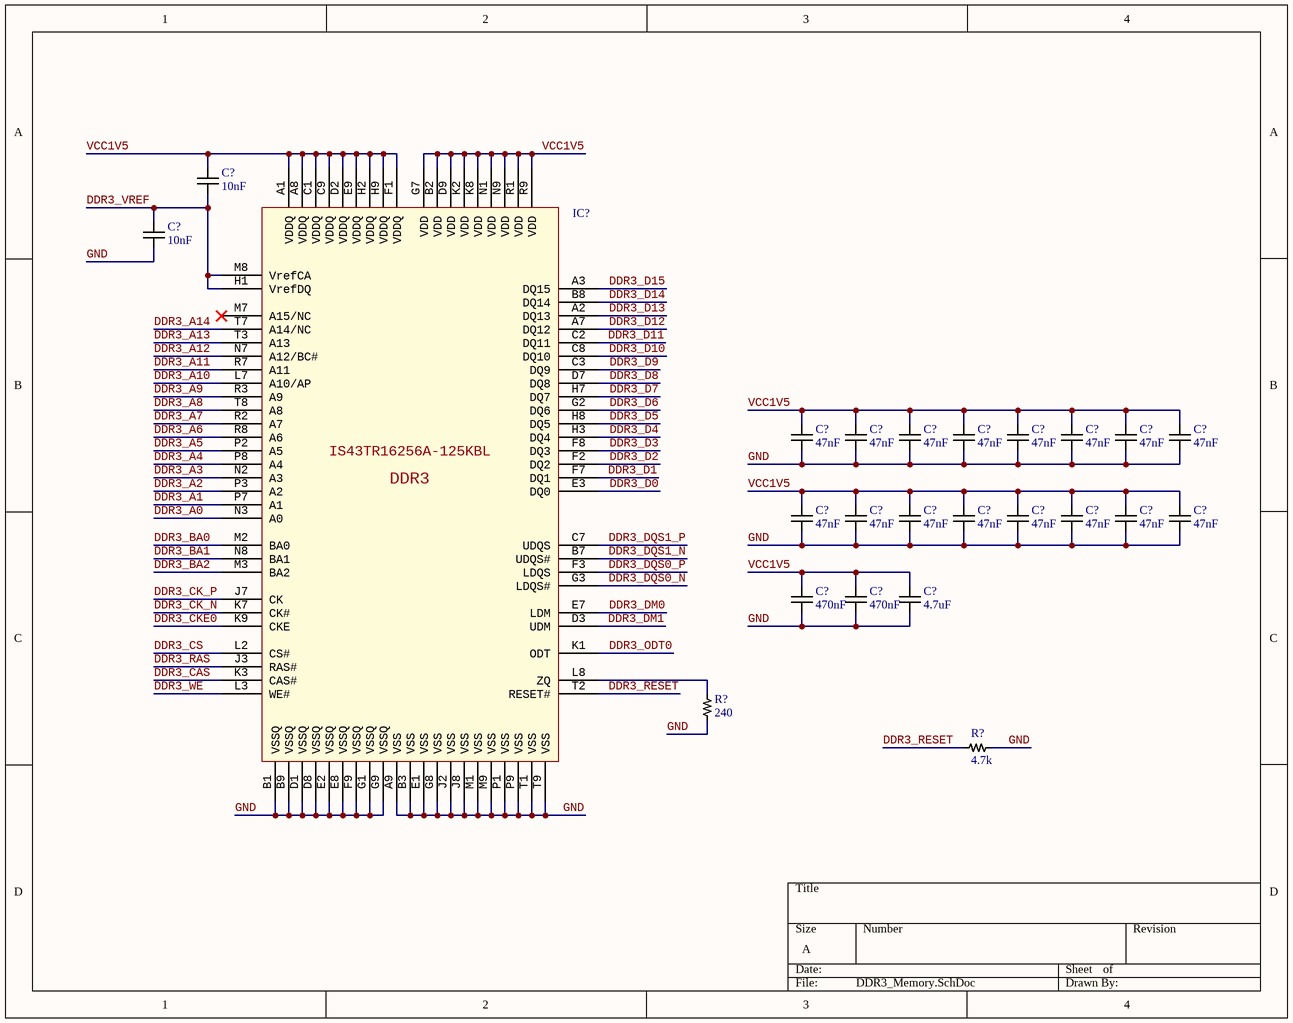
[diagram p8: DDR3_Memory.SchDoc]

### Parts
(Parts that share a designator on the sheet are numbered #1, #2 ... from top to bottom, then left to right.)
C?#70  10nF  [CAP0402]
C?#71  10nF  [CAP0402]
C?#72  47nF  [CAP0402]
C?#73  47nF  [CAP0402]
C?#74  47nF  [CAP0402]
C?#75  47nF  [CAP0402]
C?#76  47nF  [CAP0402]
C?#77  47nF  [CAP0402]
C?#78  47nF  [CAP0402]
C?#79  47nF  [CAP0402]
C?#80  47nF  [CAP0402]
C?#81  47nF  [CAP0402]
C?#82  47nF  [CAP0402]
C?#83  47nF  [CAP0402]
C?#84  47nF  [CAP0402]
C?#85  47nF  [CAP0402]
C?#86  47nF  [CAP0402]
C?#87  47nF  [CAP0402]
C?#88  470nF  [CAP0603]
C?#89  470nF  [CAP0603]
C?#90  4.7uF  [CAP0805]
IC?#13  IS43TR16256A-125KBL  [BGA96]  (value not drawn)
R?#135  240  [RES0402]
R?#136  4.7k  [RES0402]

### Nets
GND: C?#71.2 C?#72.2 C?#73.2 C?#74.2 C?#75.2 C?#76.2 C?#77.2 C?#78.2 C?#79.2 C?#80.2 C?#81.2 C?#82.2 C?#83.2 C?#84.2 C?#85.2 C?#86.2 C?#87.2 C?#88.2 C?#89.2 C?#90.2 IC?#13.A9(VSS) IC?#13.B1(VSSQ) IC?#13.B3(VSS) IC?#13.B9(VSSQ) IC?#13.D1(VSSQ) IC?#13.D8(VSSQ) IC?#13.E1(VSS) IC?#13.E2(VSSQ) IC?#13.E8(VSSQ) IC?#13.F9(VSSQ) IC?#13.G1(VSSQ) IC?#13.G8(VSS) IC?#13.G9(VSSQ) IC?#13.J2(VSS) IC?#13.J8(VSS) IC?#13.M1(VSS) IC?#13.M9(VSS) IC?#13.P1(VSS) IC?#13.P9(VSS) IC?#13.T1(VSS) IC?#13.T9(VSS) R?#135.1 R?#136.2
DDR3_A0: IC?#13.N3(A0)
DDR3_A1: IC?#13.P7(A1)
DDR3_A2: IC?#13.P3(A2)
DDR3_A3: IC?#13.N2(A3)
DDR3_A4: IC?#13.P8(A4)
DDR3_A5: IC?#13.P2(A5)
DDR3_A6: IC?#13.R8(A6)
DDR3_A7: IC?#13.R2(A7)
DDR3_A8: IC?#13.T8(A8)
DDR3_A9: IC?#13.R3(A9)
DDR3_A10: IC?#13.L7(A10/AP)
DDR3_A11: IC?#13.R7(A11)
DDR3_A12: IC?#13.N7(A12/BC#)
DDR3_A13: IC?#13.T3(A13)
DDR3_A14: IC?#13.T7(A14/NC)
DDR3_BA0: IC?#13.M2(BA0)
DDR3_BA1: IC?#13.N8(BA1)
DDR3_BA2: IC?#13.M3(BA2)
DDR3_CAS: IC?#13.K3(CAS#)
DDR3_CK_N: IC?#13.K7(CK#)
DDR3_CK_P: IC?#13.J7(CK)
DDR3_CKE0: IC?#13.K9(CKE)
DDR3_CS: IC?#13.L2(CS#)
DDR3_D0: IC?#13.E3(DQ0)
DDR3_D1: IC?#13.F7(DQ1)
DDR3_D2: IC?#13.F2(DQ2)
DDR3_D3: IC?#13.F8(DQ3)
DDR3_D4: IC?#13.H3(DQ4)
DDR3_D5: IC?#13.H8(DQ5)
DDR3_D6: IC?#13.G2(DQ6)
DDR3_D7: IC?#13.H7(DQ7)
DDR3_D8: IC?#13.D7(DQ8)
DDR3_D9: IC?#13.C3(DQ9)
DDR3_D10: IC?#13.C8(DQ10)
DDR3_D11: IC?#13.C2(DQ11)
DDR3_D12: IC?#13.A7(DQ12)
DDR3_D13: IC?#13.A2(DQ13)
DDR3_D14: IC?#13.B8(DQ14)
DDR3_D15: IC?#13.A3(DQ15)
DDR3_DM0: IC?#13.E7(LDM)
DDR3_DM1: IC?#13.D3(UDM)
DDR3_DQS0_N: IC?#13.G3(LDQS#)
DDR3_DQS0_P: IC?#13.F3(LDQS)
DDR3_DQS1_N: IC?#13.B7(UDQS#)
DDR3_DQS1_P: IC?#13.C7(UDQS)
DDR3_ODT0: IC?#13.K1(ODT)
DDR3_RAS: IC?#13.J3(RAS#)
DDR3_RESET: IC?#13.T2(RESET#) R?#136.1
DDR3_VREF: C?#70.2 C?#71.1 IC?#13.H1(VrefDQ) IC?#13.M8(VrefCA)
DDR3_WE: IC?#13.L3(WE#)
VCC1V5: C?#70.1 C?#72.1 C?#73.1 C?#74.1 C?#75.1 C?#76.1 C?#77.1 C?#78.1 C?#79.1 C?#80.1 C?#81.1 C?#82.1 C?#83.1 C?#84.1 C?#85.1 C?#86.1 C?#87.1 C?#88.1 C?#89.1 C?#90.1 IC?#13.A1(VDDQ) IC?#13.A8(VDDQ) IC?#13.B2(VDD) IC?#13.C1(VDDQ) IC?#13.C9(VDDQ) IC?#13.D2(VDDQ) IC?#13.D9(VDD) IC?#13.E9(VDDQ) IC?#13.F1(VDDQ) IC?#13.G7(VDD) IC?#13.H2(VDDQ) IC?#13.H9(VDDQ) IC?#13.K2(VDD) IC?#13.K8(VDD) IC?#13.N1(VDD) IC?#13.N9(VDD) IC?#13.R1(VDD) IC?#13.R9(VDD)
NetIC?#13_L8: IC?#13.L8(ZQ) R?#135.2

Not connected (* = marked no-connect by the designer): IC?#13 M7(A15/NC)*

### Notes on the sheet
- (in symbol IS43TR16256A-125KBL) DDR3

### Library data of the parts
C?#70 C?#71 = GRM155R71H103KA88D: MLCC 10nF 0402 SMD; Manufacturer: Murata; Material: Ceramic; Tolerance: 10%; Voltage Rating: 50V; Dielectric: X7R; Voltage: 25V; Supplier 1: Digi-Key; Manufacturer Part Number: GRM155R71H103KA88D; Stock 1: 7384657; Pricing 1: 1=0.10000, 10=0.03800, 100=0.01690, 500=0.01208, 1000=0.00949, 2500=0.00862, 5000=0.00794 (USD); RoHS: Yes; Mount: Surface Mount; Case/Package: 0402; Number of Pins: 2; Case Code (Metric): 1005; Case Code (Imperial): 0402; Min Operating Temperature: -55°C; Max Operating Temperature: 125°C; Packaging: Tape and Reel; Package Quantity: 1; Termination: SMD/SMT; Capacitance: 10nF; Voltage Rating (DC): 50V; Length: 1mm; Height: 0.5mm; Width: 0.02inch; Thickness: 0.022inch; Depth: 0.5mm; Radiation Hardening: No; REACH SVHC: No SVHC; Lead Free: Lead Free; ComponentLink1URL: https://datasheet.ciiva.com/129/product-129810.pdf?src-supplier=Digi-Key; ComponentLink1Description: https://datasheet.ciiva.com/129/product-129810.pdf?src-supplier=Digi-Key; ComponentLink2URL: https://datasheet.ciiva.com/19476/1856433-19476546.pdf?src-supplier=Jameco; ComponentLink2Description: https://datasheet.ciiva.com/19476/1856433-19476546.pdf?src-supplier=Jameco; ComponentLink3URL: https://datasheet.ciiva.com/11786/0900766b80ef921d-11786340.pdf?src-supplier=RSComponents; ComponentLink3Description: https://datasheet.ciiva.com/11786/0900766b80ef921d-11786340.pdf?src-supplier=RSComponents; ComponentLink4URL: https://datasheet.ciiva.com/18100/getdatasheetpartid-27434-18100660.pdf?src-supplier=Verical; ComponentLink4Description: https://datasheet.ciiva.com/18100/getdatasheetpartid-27434-18100660.pdf?src-supplier=Verical; ComponentLink5URL: https://datasheet.ciiva.com/22698/1747449-22698420.pdf?src-supplier=Element14; ComponentLink5Description: https://datasheet.ciiva.com/22698/1747449-22698420.pdf?src-supplier=Element14; ComponentLink6URL: https://datasheet.ciiva.com/29199/454225-da-01-en-vs-kondensator-0402-29199740.pdf?src-supplier=Conrad; ComponentLink6Description: https://datasheet.ciiva.com/29199/454225-da-01-en-vs-kondensator-0402-29199740.pdf?src-supplier=Conrad; ComponentLink7URL: https://datasheet.ciiva.com/129/grm155r71h103ka88-01-129811.pdf?src-supplier=Digi-Key; ComponentLink7Description: https://datasheet.ciiva.com/129/grm155r71h103ka88-01-129811.pdf?src-supplier=Digi-Key; ComponentLink8URL: https://datasheet.ciiva.com/129/grm155r71h103ka88-01-129812.pdf?src-supplier=Digi-Key; ComponentLink8Description: https://datasheet.ciiva.com/129/grm155r71h103ka88-01-129812.pdf?src-supplier=Digi-Key; ComponentLink9URL: https://datasheet.ciiva.com/16495/product-16495290.pdf?src-supplier=Future+Electronics; ComponentLink9Description: https://datasheet.ciiva.com/16495/product-16495290.pdf?src-supplier=Future+Electronics; ComponentLink10URL: https://datasheet.ciiva.com/5410/product-5410990.pdf?src-supplier=Mouser; ComponentLink10Description: https://datasheet.ciiva.com/5410/product-5410990.pdf?src-supplier=Mouser
C?#72-C?#87 = GRM155R71E473KA88D: MLCC 47nF 0402 SMD; Manufacturer: Murata; Material: Ceramic; Tolerance: 10%; Voltage Rating: 25V; Dielectric: X7R; Supplier 1: Digi-Key; Manufacturer Part Number: GRM155R71E473KA88D; Stock 1: 1130633; Pricing 1: 1=0.10000, 10=0.06300, 100=0.02820, 500=0.02012, 1000=0.01581, 2500=0.01438, 5000=0.01323 (USD); RoHS: Yes; Mount: Surface Mount; Case/Package: 0402; Number of Pins: 2; Case Code (Metric): 1005; Case Code (Imperial): 0402; Min Operating Temperature: -55°C; Max Operating Temperature: 125°C; Capacitance: 47nF; Package Quantity: 1; Packaging: Tape and Reel; Termination: SMD/SMT; Voltage: 25V; Voltage Rating (DC): 25V; Length: 1mm; Height: 0.5mm; Width: 0.02inch; Thickness: 0.022inch; Depth: 0.5mm; Radiation Hardening: No; REACH SVHC: No SVHC; Lead Free: Lead Free; ComponentLink1URL: https://datasheet.ciiva.com/131/grm155r71e473ka88-01-131494.pdf?src-supplier=Digi-Key; ComponentLink1Description: https://datasheet.ciiva.com/131/grm155r71e473ka88-01-131494.pdf?src-supplier=Digi-Key; ComponentLink2URL: https://datasheet.ciiva.com/34302/1856425-34302854.pdf?src-supplier=Jameco; ComponentLink2Description: https://datasheet.ciiva.com/34302/1856425-34302854.pdf?src-supplier=Jameco; ComponentLink3URL: https://datasheet.ciiva.com/18184/getdatasheetpartid-153136-18184712.pdf?src-supplier=Verical; ComponentLink3Description: https://datasheet.ciiva.com/18184/getdatasheetpartid-153136-18184712.pdf?src-supplier=Verical; ComponentLink4URL: https://datasheet.ciiva.com/29199/454180-da-01-en-vs-kondensator-0402-29199826.pdf?src-supplier=Conrad; ComponentLink4Description: https://datasheet.ciiva.com/29199/454180-da-01-en-vs-kondensator-0402-29199826.pdf?src-supplier=Conrad; ComponentLink5URL: https://datasheet.ciiva.com/2989/product-2989395.pdf?src-supplier=Avnet; ComponentLink5Description: https://datasheet.ciiva.com/2989/product-2989395.pdf?src-supplier=Avnet; ComponentLink6URL: https://datasheet.ciiva.com/131/grm155r71e473ka88-01-131492.pdf?src-supplier=Digi-Key; ComponentLink6Description: https://datasheet.ciiva.com/131/grm155r71e473ka88-01-131492.pdf?src-supplier=Digi-Key; ComponentLink7URL: https://datasheet.ciiva.com/131/grm155r71e473ka88-01-131493.pdf?src-supplier=Digi-Key; ComponentLink7Description: https://datasheet.ciiva.com/131/grm155r71e473ka88-01-131493.pdf?src-supplier=Digi-Key; ComponentLink8URL: https://datasheet.ciiva.com/7937/608985-7937623.pdf?src-supplier=Element14; ComponentLink8Description: https://datasheet.ciiva.com/7937/608985-7937623.pdf?src-supplier=Element14; ComponentLink9URL: https://datasheet.ciiva.com/14103/grmseries-highdielectrictype-eng-14103754.pdf?src-supplier=Distrelec; ComponentLink9Description: https://datasheet.ciiva.com/14103/grmseries-highdielectrictype-eng-14103754.pdf?src-supplier=Distrelec; ComponentLink10URL: https://datasheet.ciiva.com/5424/product-5424844.pdf?src-supplier=Mouser; ComponentLink10Description: https://datasheet.ciiva.com/5424/product-5424844.pdf?src-supplier=Mouser
C?#88 C?#89 = GRM188R70J474KA01D: MLCC 470nF 0603 SMD; pin to pad: 2>none; Manufacturer: Murata; Voltage Rating: 6.3V; Tolerance: 10%; Dielectric: X7R; Supplier 1: Digi-Key; Manufacturer Part Number: GRM188R70J474KA01D; Stock 1: 92537; Pricing 1: 1=0.17000, 10=0.11700, 100=0.05940, 500=0.04066, 1000=0.03597 (USD); RoHS: Yes; Mount: Surface Mount; Case/Package: 0603; Case Code (Metric): 1608; Case Code (Imperial): 0603; Min Operating Temperature: -55°C; Max Operating Temperature: 125°C; Package Quantity: 4000; Capacitance: 470nF; Packaging: Tape and Reel; Voltage Rating (DC): 6.3V; Termination: SMD/SMT; Length: 1.6mm; Height: 0.8mm; Width: 0.031inch; Thickness: 0.035inch; Depth: 0.8mm; Radiation Hardening: No; Lead Free: Lead Free; ComponentLink1URL: https://datasheet.ciiva.com/6264/product-6264161.pdf?src-supplier=Digi-Key; ComponentLink1Description: https://datasheet.ciiva.com/6264/product-6264161.pdf?src-supplier=Digi-Key; ComponentLink2URL: https://datasheet.ciiva.com/11673/product-11673478.pdf?src-supplier=Avnet; ComponentLink2Description: https://datasheet.ciiva.com/11673/product-11673478.pdf?src-supplier=Avnet; ComponentLink3URL: https://datasheet.ciiva.com/6264/partnumbering-e-01-6264159.pdf?src-supplier=Digi-Key; ComponentLink3Description: https://datasheet.ciiva.com/6264/partnumbering-e-01-6264159.pdf?src-supplier=Digi-Key
C?#90 = C2012X7R1A475K085AC: as C?#17 on sheet FPGA_Power; Supplier 1: Digi-Key; Manufacturer Part Number: C2012X7R1A475K085AC; Stock 1: 87407; Pricing 1: 1=0.22000, 10=0.15200, 100=0.08600, 500=0.06072, 1000=0.05313 (USD); RoHS: Yes; Mount: Surface Mount; Case/Package: 0805; Case Code (Metric): 2012; Case Code (Imperial): 0805; Min Operating Temperature: -55°C; Max Operating Temperature: 125°C; Package Quantity: 4000; Packaging: Cut Tape; Capacitance: 4.7uF; Voltage Rating (DC): 10V; Length: 0.079inch; Width: 0.049inch; Thickness: 0.039inch; REACH SVHC: No SVHC; Lead Free: Lead Free; ComponentLink1URL: https://datasheet.ciiva.com/14886/tdkmlcccaprange-14886121.pdf?src-supplier=Digi-Key; ComponentLink1Description: https://datasheet.ciiva.com/14886/tdkmlcccaprange-14886121.pdf?src-supplier=Digi-Key; ComponentLink2Description: https://product.tdk.com/info/en/catalog/datasheets/mlcc_commercial_general_en.pdf; ComponentLink2URL: https://product.tdk.com/info/en/catalog/datasheets/mlcc_commercial_general_en.pdf
IC?#13 = IS43TR16256A-125KBL: DRAM 4G, 1.5V, 1600Mhz DDR3 SDRAM; Manufacturer: ISSI; Max Supply Voltage: 1.575V; Min Supply Voltage: 1.425V; Data Bus Width: 16b; Memory Size: 4Gb; Memory Type: RAM,DDR3 SDRAM; Frequency: 800MHz; Interface: Parallel; Max Supply Current: 290mA; Address Bus Width: 18b; Access Time: 20ns; Nominal Supply Current: 230mA; Supplier 1: Mouser; Manufacturer Part Number: IS43TR16256A-125KBL; Stock 1: 380; Pricing 1: 1=8.69000, 10=8.00000, 25=7.81000, 50=7.81000, 100=7.00000, 250=6.79000, 500=6.46000, 1000=6.46000, 10000=6.46000 (USD); RoHS: Yes; Mount: Surface Mount; Case/Package: TFBGA; Number of Pins: 96; Min Operating Temperature: 0°C; Max Operating Temperature: 95°C; Packaging: Tray; Package Quantity: 190; Max Frequency: 800MHz; Operating Supply Voltage: 1.5V; Density: 4Gb; ComponentLink2URL: http://www.mouser.com/ds/2/198/43-46TR16256A-85120AL-268426.pdf?src-supplier=Mouser; ComponentLink2Description: http://www.mouser.com/ds/2/198/43-46TR16256A-85120AL-268426.pdf?src-supplier=Mouser; ComponentLink1URL: http://components.arrow.com/part/dataview/0323_06942300?src-supplier=Arrow+Europe; ComponentLink1Description: http://components.arrow.com/part/dataview/0323_06942300?src-supplier=Arrow+Europe; ComponentLink3URL: http://www.issi.com/WW/pdf/43-46TR16256A-85120AL.pdf?src-supplier=Digi-Key; ComponentLink3Description: http://www.issi.com/WW/pdf/43-46TR16256A-85120AL.pdf?src-supplier=Digi-Key
R?#135 = RC0402FR-07240RL: Resistor 240Ohm 0402 SMD; Manufacturer: Yageo Phycomp; Tolerance: 1%; Power Rating: 63mW; Temperature Coefficient: 100ppm/°C; Voltage Rating (DC): 50V; Resistance: 240R; Supplier 1: Digi-Key; Manufacturer Part Number: RC0402FR-07240RL; Stock 1: 5368761; Pricing 1: 1=0.10000, 10=0.01600, 100=0.00670, 1000=0.00301, 2500=0.00261, 5000=0.00215 (USD); RoHS: Yes; Mount: Surface Mount; Case/Package: 0402; Number of Pins: 2; Min Operating Temperature: -55°C; Max Operating Temperature: 155°C; Packaging: Cut Tape; Length: 1mm; Height: 0.32mm; Depth: 0.5mm; REACH SVHC: No SVHC; Lead Free: Lead Free; ComponentLink1URL: http://www.mouser.com/ds/2/447/PYu-RC0402_51_RoHS_L_6_r-8721.pdf?src-supplier=Mouser; ComponentLink1Description: http://www.mouser.com/ds/2/447/PYu-RC0402_51_RoHS_L_6_r-8721.pdf?src-supplier=Mouser; ComponentLink2URL: http://www.farnell.com/datasheets/2167052.pdf?src-supplier=Farnell; ComponentLink2Description: http://www.farnell.com/datasheets/2167052.pdf?src-supplier=Farnell; ComponentLink3URL: http://www.yageo.com/documents/recent/PYu-RC_Group_51_RoHS_L_9.pdf?src-supplier=Digi-Key; ComponentLink3Description: http://www.yageo.com/documents/recent/PYu-RC_Group_51_RoHS_L_9.pdf?src-supplier=Digi-Key; ComponentLink4URL: http://www.yageo.com/documents/recent/PYu-RC_Group_51_RoHS_L_10.pdf?src-supplier=Digi-Key; ComponentLink4Description: http://www.yageo.com/documents/recent/PYu-RC_Group_51_RoHS_L_10.pdf?src-supplier=Digi-Key; ComponentLink5URL: http://www.farnell.com/datasheets/2167052.pdf?src-supplier=Element14; ComponentLink5Description: http://www.farnell.com/datasheets/2167052.pdf?src-supplier=Element14
R?#136 = RC0402FR-074K7L: Resistor 4.7kOhm 0402 SMD; Manufacturer: Yageo; Voltage Rating (DC): 50V; Tolerance: 1%; Power Rating: 62.5mW; Resistance: 4.7kR; Temperature Coefficient: 100ppm/°C; Supplier 1: Digi-Key; Manufacturer Part Number: RC0402FR-074K7L; Stock 1: 23742940; Pricing 1: 1=0.10000, 10=0.01600, 100=0.00670, 1000=0.00301, 2500=0.00261, 5000=0.00215 (USD); RoHS: Yes; Case/Package: 0402; Number of Pins: 2; Case Code (Imperial): 0402; Case Code (Metric): 1005; Min Operating Temperature: -55°C; Max Operating Temperature: 155°C; Voltage Rating: 50V; Packaging: Tape and Reel; Composition: Thick Film; Termination: SMD/SMT; Military Standard: Not; Length: 1mm; Height: 0.32mm; Width: 0.5mm; Depth: 0.5mm; REACH SVHC: No SVHC; Lead Free: Lead Free; ComponentLink1URL: https://datasheet.ciiva.com/7850/1018594-7850022.pdf?src-supplier=Element14; ComponentLink1Description: https://datasheet.ciiva.com/7850/1018594-7850022.pdf?src-supplier=Element14; ComponentLink2URL: https://datasheet.ciiva.com/7850/1018594-7850023.pdf?src-supplier=Element14; ComponentLink2Description: https://datasheet.ciiva.com/7850/1018594-7850023.pdf?src-supplier=Element14; ComponentLink3URL: https://datasheet.ciiva.com/15215/getdatasheetpartid-328119-15215035.pdf?src-supplier=Verical; ComponentLink3Description: https://datasheet.ciiva.com/15215/getdatasheetpartid-328119-15215035.pdf?src-supplier=Verical; ComponentLink4URL: https://datasheet.ciiva.com/22661/1686128-22661342.pdf?src-supplier=Element14; ComponentLink4Description: https://datasheet.ciiva.com/22661/1686128-22661342.pdf?src-supplier=Element14